# EAGLE design schematic (EAGLE 9.6.2)
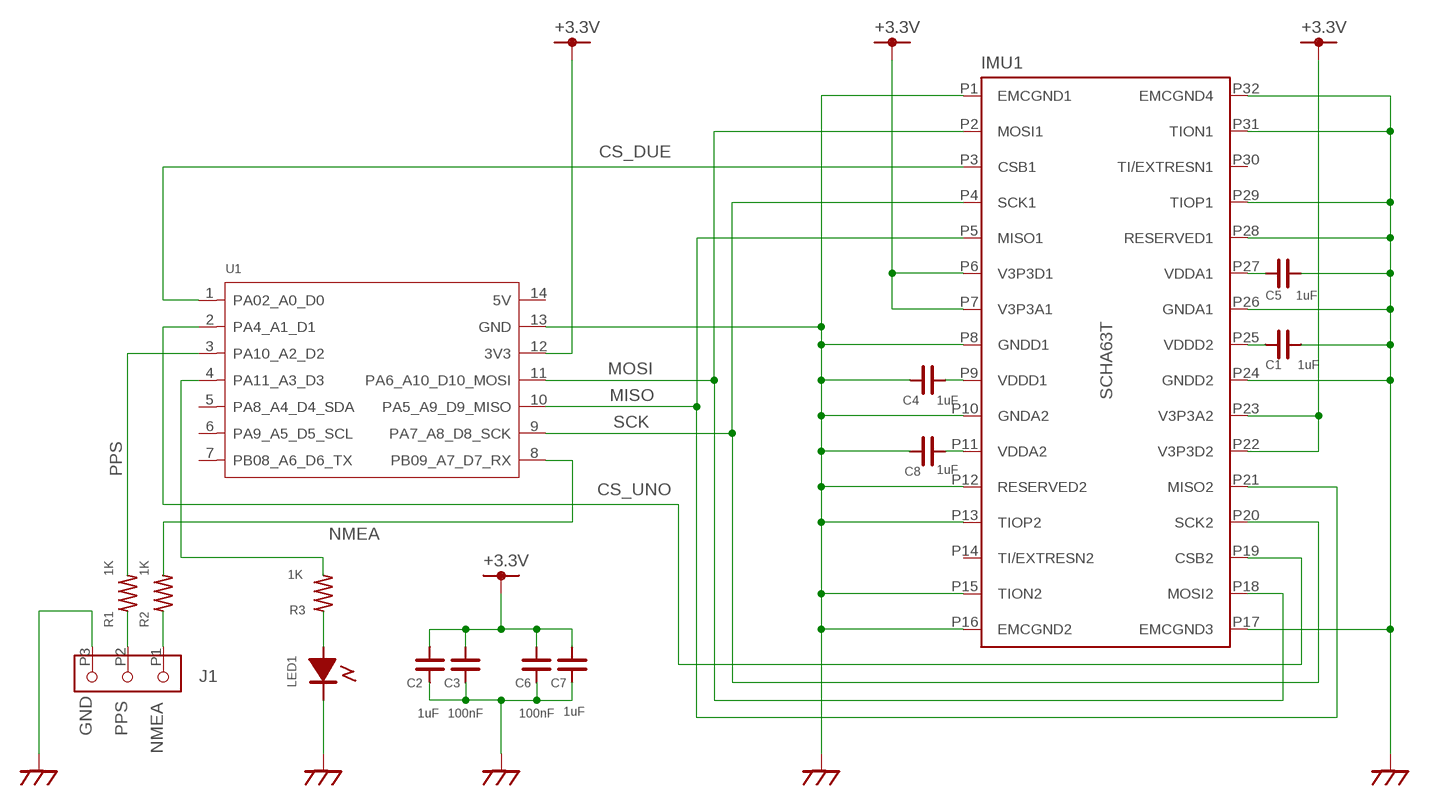
[diagram p0: schematic, sheet 1]

## Parts
C1  1uF  C1608  [C1608]
C2  1uF  C1608  [C1608]
C3  100nF  C1608  [C1608]
C4  1uF  C1608  [C1608]
C5  1uF  C1608  [C1608]
C6  100nF  C1608  [C1608]
C7  1uF  C1608  [C1608]
C8  1uF  C1608  [C1608]
IMU1  SCHA63T  [SOIC-32]
J1  JST_SH_10_3P  [JST_SH_10_3P]
LED1  LED1608  [LED_1608]
R1  1K  R1608  [C1608]
R2  1K  R1608  [C1608]
R3  1K  R1608  [C1608]
U1  MOUDLE-SEEEDUINO-XIAO  [MOUDLE14P-2.54-21X17.8MM]

## Nets
+3.3V: C2.2 C3.2 C6.2 C7.2 IMU1.P6(V3P3D1) IMU1.P7(V3P3A1) IMU1.P22(V3P3D2) IMU1.P23(V3P3A2) U1.12(3V3)
CS_DUE: IMU1.P3(CSB1) U1.1(PA02_A0_D0)
CS_UNO: IMU1.P19(CSB2) U1.2(PA4_A1_D1)
GND: C1.2 C2.1 C3.1 C4.1 C5.2 C6.1 C7.1 C8.1 IMU1.P1(EMCGND1) IMU1.P8(GNDD1) IMU1.P10(GNDA2) IMU1.P12(RESERVED2) IMU1.P13(TIOP2) IMU1.P15(TION2) IMU1.P16(EMCGND2) IMU1.P17(EMCGND3) IMU1.P24(GNDD2) IMU1.P26(GNDA1) IMU1.P28(RESERVED1) IMU1.P29(TIOP1) IMU1.P31(TION1) IMU1.P32(EMCGND4) J1.P3 LED1.2 U1.13(GND)
MISO: IMU1.P5(MISO1) IMU1.P21(MISO2) U1.10(PA5_A9_D9_MISO)
MOSI: IMU1.P2(MOSI1) IMU1.P18(MOSI2) U1.11(PA6_A10_D10_MOSI)
N$1: C5.1 IMU1.P27(VDDA1)
N$2: C1.1 IMU1.P25(VDDD2)
N$3: C4.2 IMU1.P9(VDDD1)
N$4: C8.2 IMU1.P11(VDDA2)
N$5: J1.P2 R1.1
N$6: J1.P1 R2.1
N$7: LED1.1(+) R3.1
N$8: R3.2 U1.4(PA11_A3_D3)
NMEA: R2.2 U1.8(PB09_A7_D7_RX)
PPS: R1.2 U1.3(PA10_A2_D2)
SCK: IMU1.P4(SCK1) IMU1.P20(SCK2) U1.9(PA7_A8_D8_SCK)
Unconnected: IMU1.P14(TI/EXTRESN2) IMU1.P30(TI/EXTRESN1) U1.5(PA8_A4_D4_SDA) U1.6(PA9_A5_D5_SCL) U1.7(PB08_A6_D6_TX) U1.14(5V)

## Notes on the sheet
- GND | PPS
- NMEA

## Library data of the parts
C1-C8 = ttaka_desc:C1608
IMU1 = ttaka_ic:SCHA63T
J1 = ublox:JST_SH_10_3P
LED1 = ttaka_desc:LED1608
R1-R3 = ublox:R1608
U1 = Seeeduino XIAO:MOUDLE-SEEEDUINO-XIAO

## Net classes
1 pow: width 0.254 mm
2 gnd: width 0.254 mm
3 rf: width 0.254 mm

## Board
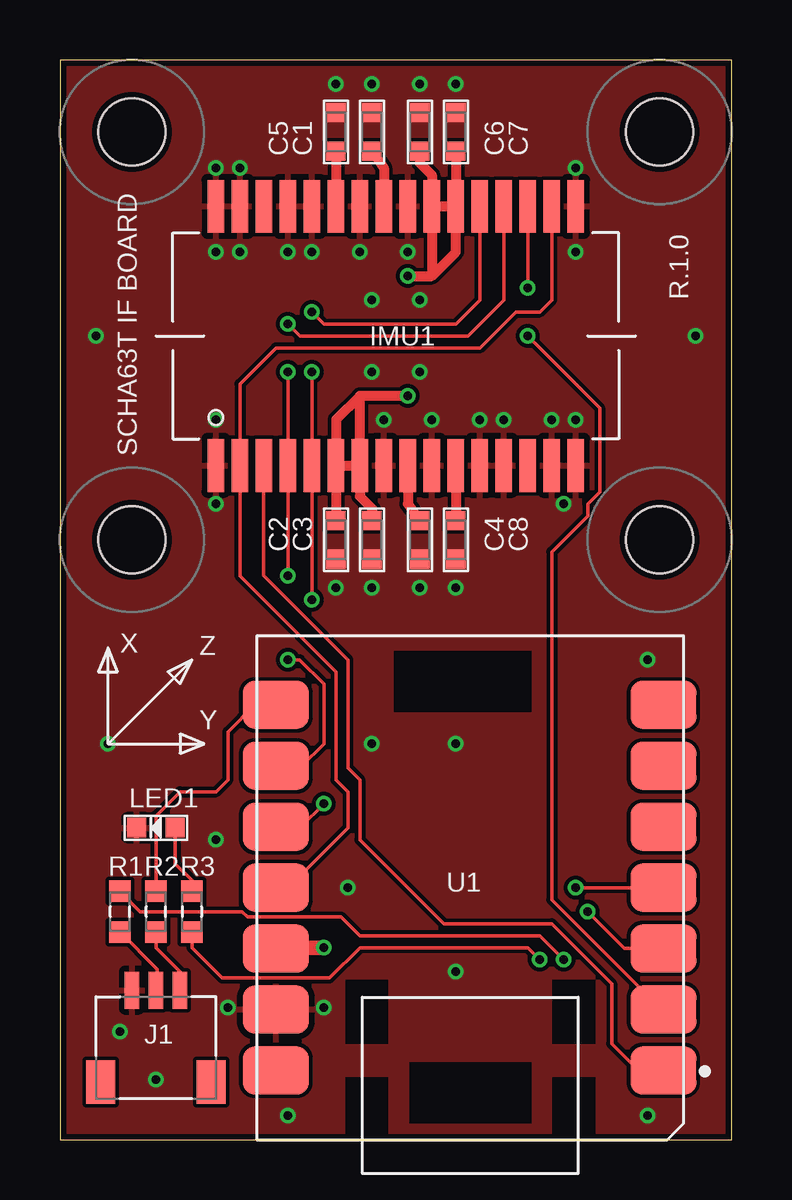
[diagram p1: board, top side]
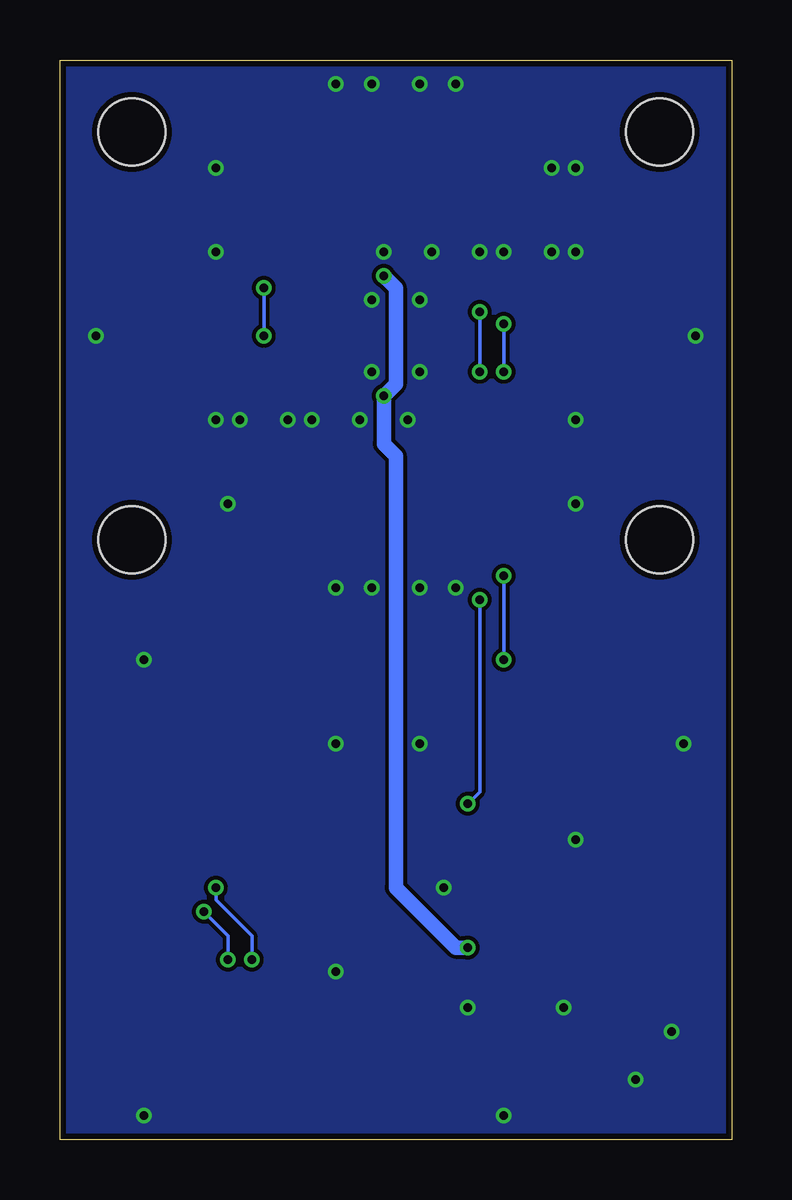
[diagram p2: board, bottom side, seen from below]

Size 28 x 45 mm. Coordinates in mm from the lower left corner, seen from the top.
Outline: 0,0 28,0 28,45 0,45 0,0
Copper layers (1*16): Top 0.035mm / dielectric 1.5mm / Bottom 0.035mm
Design rules "SeeedStudio_2layer_DRU_no_angle_20140221": minimum track width 6mil, minimum drill 12mil, track to track 6mil, track to pad 6mil, pad to pad 6mil, via to via 6mil, smd to smd 0mil, copper to edge 10mil, drill to drill 10mil, minimum pad ring 10mil, minimum via ring 6mil, stop-mask expansion 2mil, vias tented up to drill 100mil, thermal gap 10mil
Holes 2.8 mm at 3,42 25,42 3,25 25,25

### Footprints (pad centres in the part's own frame; a part is rotated, then mirrored left to right if it is on the bottom)
C1608 = smd 0.8 x 0.8: 1 -0.8,0; 2 0.8,0
SOIC-32 = smd 0.7 x 2.2: P1 -7.5,-5.4; P2 -6.5,-5.4; P3 -5.5,-5.4; P4 -4.5,-5.4; P5 -3.5,-5.4; P6 -2.5,-5.4; P7 -1.5,-5.4; P8 -0.5,-5.4; P9 0.5,-5.4; P10 1.5,-5.4; P11 2.5,-5.4; P12 3.5,-5.4; P13 4.5,-5.4; P14 5.5,-5.4; P15 6.5,-5.4; P16 7.5,-5.4; P17 7.5,5.4; P18 6.5,5.4; P19 5.5,5.4; P20 4.5,5.4; P21 3.5,5.4; P22 2.5,5.4; P23 1.5,5.4; P24 0.5,5.4; P25 -0.5,5.4; P26 -1.5,5.4; P27 -2.5,5.4; P28 -3.5,5.4; P29 -4.5,5.4; P30 -5.5,5.4; P31 -6.5,5.4; P32 -7.5,5.4
JST_SH_10_3P = smd 1.2 x 1.8: G1 -2.3,-0.9; G2 2.3,-0.9 | smd 0.6 x 1.55: P1 -1,-4.725; P2 0,-4.725; P3 1,-4.725
LED_1608 = smd 0.8 x 0.8: 1 -0.8,0; 2 0.8,0
C1608' = smd 0.9 x 0.9: 1 -0.85,0; 2 0.85,0
MOUDLE14P-2.54-21X17.8MM = smd 2.75 x 2: 1 0.835,18.12; 2 0.835,15.58; 3 0.835,13.04; 4 0.835,10.5; 5 0.835,7.96; 6 0.835,5.42; 7 0.835,2.88; 8 17,2.88; 9 17,5.42; 10 17,7.96; 11 17,10.5; 12 17,13.04; 13 17,15.58; 14 17,18.12

### Placement (x,y rotation side)
C1  13,42 90 top
C2  11.5,25 90 top
C3  13,25 90 top
C4  15,25 90 top
C5  11.5,42 90 top
C6  15,42 270 top
C7  16.5,42 270 top
C8  16.5,25 90 top
IMU1  14,33.5 0 top
J1  4,1.5 180 top
LED1  4,13 180 top
R1  1K  [C1608']  2.5,9.5 90 top
R2  1K  [C1608']  4,9.5 90 top
R3  1K  [C1608']  5.5,9.5 270 top
U1  26,21 180 top

### Tracks (layer width: path | path; a pad name or v marks a point on that pad's centre or on a via)
+3.3V  (via drill 0.35)
  Top 0.152: C2.2 | 13.01,25.79 C3.2 | 11.52,28.1 IMU1.P6
  Top 0.254: IMU1.P6 | U1.12 9.04,8
  Top 0.406: IMU1.P7 12.5,26.8 13.01,26.29 13.01,25.79 | IMU1.P6 C2.2 | v14.5,31 12.5,31 | 12.5,31 11.52,30.02 11.52,28.1 | IMU1.P7 12.5,31 | v14.5,36 15.5,36 | 15.5,36 16.5,37 IMU1.P22 | IMU1.P23 15.5,36 | C7.2 IMU1.P22 | C6.2 15,40.7 15.5,40.2 IMU1.P23 | IMU1.P6 IMU1.P7 | IMU1.P23 IMU1.P22
  Top 0.61: 9.04,8 v11,8
  Bottom 0.61: v11,8 11.5,8 14,10.5 14,28.5 14.5,29 v14.5,31 14,31.5 14,35.5 v14.5,36
CS_DUE
  Top 0.152: IMU1.P3 8.49,28.1 8.49,23.51 12,20 12,15.5 12.5,15 12.5,12.5 16,9 20.5,9 23,6.5 23,4 24.12,2.88 U1.1
CS_UNO  (via drill 0.35)
  Top 0.152: U1.2 25.12,5.38 20.5,10 20.5,24.5 22,26 22,26.5 22.5,27 22.5,30.5 v19.5,33.5 | IMU1.P19 v19.5,35.5
  Bottom 0.152: v19.5,35.5 v19.5,33.5
GND  (via drill 0.35)
  Top 0.152: 14.94,42.87 C6.1 15.09,42.87 | 16.46,42.87 C7.1 16.61,42.72 | IMU1.P26 | 10.52,38.91 IMU1.P28 10.52,38.75 | 14.48,38.75 IMU1.P24 | 11.58,24.27 C2.1 11.43,24.27 | 12.95,24.27 C3.1 13.11,24.27 | 13.56,29 13.5,28.25 IMU1.P8 | 15.39,28.24 IMU1.P10 | 17.37,28.24 IMU1.P12 17.37,28.08 | 21.49,28 21.5,28.01 IMU1.P16 21.38,28.44 21.49,28.91 | 3.05,5.64 3.05,6.1 J1.P3 3.05,6.25 | 8.32,5.42 7.77,5.18 | 6.55,28.24 IMU1.P1 6.4,28.08 | 6.55,38.75 IMU1.P32
  other vias: 7.5,40.5 21.5,40.5 14.5,37 12.5,37 13.5,30 15.5,30 21,26.5 6.5,26.5 11,5.5 2.5,4.5 12,10.5 10.5,37 17.5,30 15,35 13,32 15,32 13,35 6.5,30 21.5,30 6.5,37 21.5,37 7,5.5 15,23 13,23 16.5,23 11.5,23 11.5,44 13,44 15,44 16.5,44 7.5,37 20.5,30 6.5,40.5 9.5,37 18.5,30 1.5,33.5 26.5,33.5 2,16.5 24.5,20 24.5,1 9.5,1 16.5,16.5 13,16.5 4,2.5 6.5,12.5 16.5,7
  pour Top: -1.5,46 -1.5,-2 29.5,-2 29.5,46
  pour Bottom: -1.5,46 -1.5,-2 29.5,-2 29.5,46
MISO  (via drill 0.35)
  Top 0.152: v10.5,32 IMU1.P5 v10.5,22.5 | IMU1.P21 17.5,35 16.5,34 11,34 v10.5,34.5 | v11,14 10.04,13.04 U1.10
  Bottom 0.152: v10.5,34.5 v10.5,32 | v10.5,22.5 10.5,14.5 v11,14
MOSI
  Top 0.152: IMU1.P18 20.5,35 20,34.5 19,34.5 17.5,33 9,33 7.5,31.5 IMU1.P2 7.5,23.5 11.5,19.5 11.5,15 12,14.5 12,13 9.5,10.5 U1.11
N$1
  Top 0.406: C5.1 IMU1.P27
N$2
  Top 0.406: C1.1 13.5,40.5 IMU1.P25
N$3
  Top 0.406: IMU1.P9 14.5,26.5 C4.2
N$4
  Top 0.406: IMU1.P11 C8.2
N$5
  Top 0.152: J1.P2 4.05,6.24 4.05,7.1 R1.1
N$6
  Top 0.152: R2.1 4,8 5,7 J1.P1
N$7
  Top 0.152: LED1.1 4.8,11.5 5.5,10.8 R3.1
N$8  (via drill 0.35)
  Top 0.152: U1.4 v21.5,10.5 | v20,7.5 19.5,8 12.5,8 11.23,6.73 6.77,6.73 5.5,8 R3.2
  Bottom 0.152: v21.5,10.5 21.5,10 20,8.5 v20,7.5
NMEA
  Top 0.152: U1.8 8.12,18.12 7,17 7,15 6.5,14.5 5,14.5 4,13.5 R2.2
PPS  (via drill 0.35)
  Top 0.152: R1.2 3.35,9.5 7.59,9.5 7.82,9.27 11.73,9.27 12.5,8.5 20,8.5 v21,7.5 | v22,9.5 23.54,7.96 U1.3
  Bottom 0.152: v22,9.5 21,8.5 v21,7.5
SCK  (via drill 0.35)
  Top 0.152: U1.9 10.08,15.58 11,16.5 11,18.99 9.99,20 v9.5,20 | v9.5,23.5 IMU1.P4 v9.5,32 | v9.5,34 10,33.5 17,33.5 18.5,35 IMU1.P20
  Bottom 0.152: v9.5,23.5 v9.5,20 | v9.5,34 v9.5,32

### Text on the board
tPlace: R.1.0 | SCHA63T IF BOARD | X | Z | Y